# Altium schematic sheet Right Panel (IO).schdoc
size 156 x 74 mm
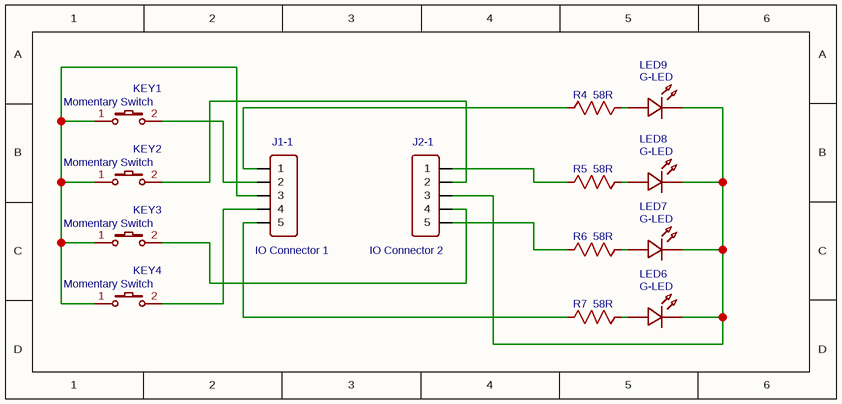
[diagram p0: Right Panel (IO).schdoc]

## Parts
J1-1  IO Connector 1  [HDR-M-2.54_1X5]
J2-1  IO Connector 2  [HDR-M-2.54_1X5]
KEY1  Momentary Switch  [KEY-SMD_2P-L6.2-W3.6-LS8.0]
KEY2  Momentary Switch  [KEY-SMD_2P-L6.2-W3.6-LS8.0]
KEY3  Momentary Switch  [KEY-SMD_2P-L6.2-W3.6-LS8.0]
KEY4  Momentary Switch  [KEY-SMD_2P-L6.2-W3.6-LS8.0]
LED6  G-LED  [LED0805_GREEN]
LED7  G-LED  [LED0805_GREEN]
LED8  G-LED  [LED0805_GREEN]
LED9  G-LED  [LED0805_GREEN]
R4  58R  [R0603]
R5  58R  [R0603]
R6  58R  [R0603]
R7  58R  [R0603]

## Nets
NetJ1-1_1: J1-1.1 R4.1
NetJ1-1_2: J1-1.2 KEY1.2
NetJ1-1_3: J1-1.3 KEY1.1 KEY2.1 KEY3.1 KEY4.1
NetJ1-1_4: J1-1.4 KEY4.2
NetJ1-1_5: J1-1.5 R7.1
NetJ2-1_1: J2-1.1(5) R6.1
NetJ2-1_2: J2-1.2(4) KEY3.2
NetJ2-1_3: J2-1.3 LED6.2 LED7.2 LED8.2 LED9.2
NetJ2-1_4: J2-1.4(2) KEY2.2
NetJ2-1_5: J2-1.5(1) R5.1
NetLED6_1: LED6.1 R7.2
NetLED7_1: LED7.1 R6.2
NetLED8_1: LED8.1 R5.2
NetLED9_1: LED9.1 R4.2

## Library data of the parts
J1-1 = IO Connector 1: Contributor: LCEDA_Lib; BOM_Supplier Part: C358687; BOM_Supplier: LCSC; spicePre: J; spiceSymbolName: HDR-M-2.54_1x5
J2-1 = IO Connector 2: Contributor: LCEDA_Lib; BOM_Supplier Part: C358687; BOM_Supplier: LCSC; spicePre: J; spiceSymbolName: HDR-M-2.54_1x5
KEY1-KEY4 = Momentary Switch: BOM_Manufacturer Part: K2-1107ST-A4SW-06; Contributor: LCEDA_Lib; 制造商: 韩国韩荣; BOM_Supplier Part: C118141; BOM_Supplier: LCSC; spicePre: K; spiceSymbolName: K2-3.6×6.1_SMD
LED6-LED9 = G-LED: BOM_Manufacturer: 国星光电; BOM_Manufacturer Part: NCD0805G1; Contributor: LCEDA_Lib; BOM_Supplier Part: C84260; spicePre: L; spiceSymbolName: LED-0805_G
R4-R7 = 58R: nameAlias: Value(Ω); Contributor: LCEDA_Lib; spicePre: R; spiceSymbolName: R_0603_US